# Altium schematic sheet Console.SchDoc
size 209 x 297 mm; SheetNumber: 4; SheetTotal: 4; PageSetup: Record=PageOptionsZCenterHorizontal=TrueZCenterVertical=TrueZPrintScale=0.95ZXCorrection=1.00ZYCorrection=1.00ZPrintKind=2ZBorderSize=5000000ZLeftOffset=0ZBottomOffset=0ZOrientation=1ZPaperLength=1000ZPaperWidth=1000ZScale=100ZPaperSource=7ZPrintQuality=600ZMediaType=1ZDitherType=10ZPaperKind=A4 (210 x 297 мм)ZPrintScaleMode=1
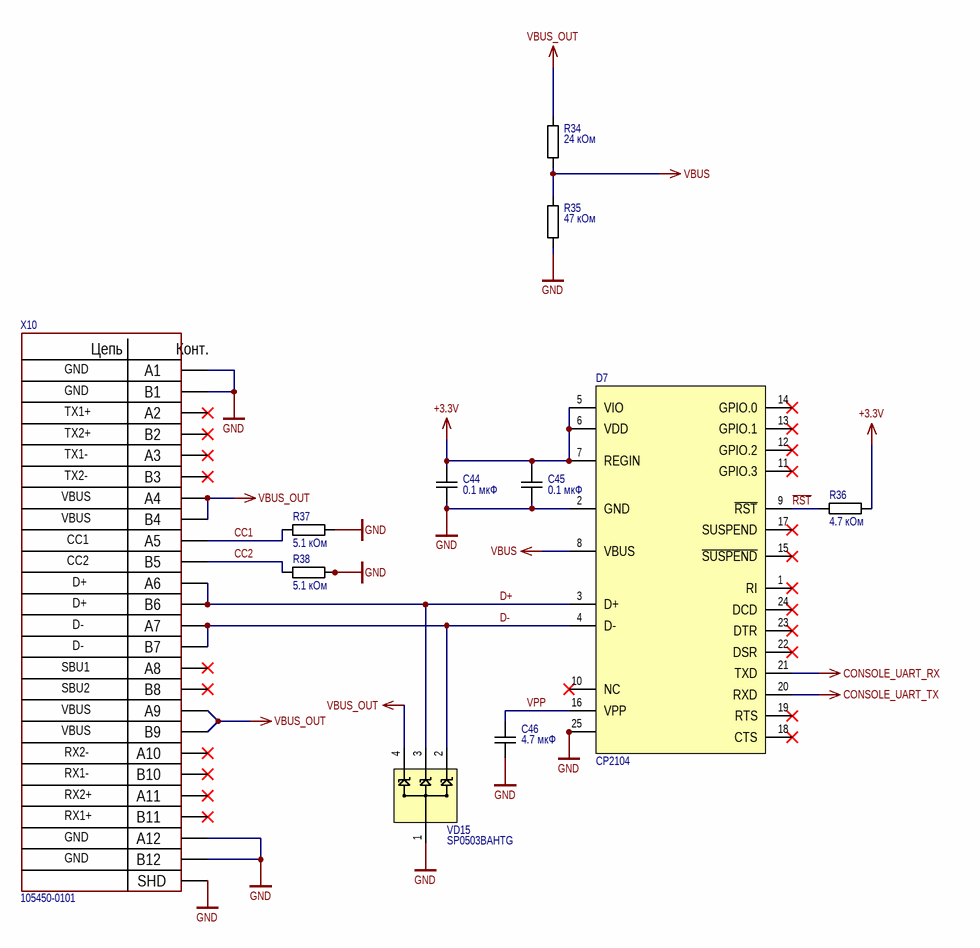
[diagram p0: Console.SchDoc]

## Parts
C44  value 0.1 мкФ  [CAP-0603]  (hidden comment: CAP-0.1 мкФ-10%-16 В-X7R-0603)
C45  value 0.1 мкФ  [CAP-0603]  (hidden comment: CAP-0.1 мкФ-10%-16 В-X7R-0603)
C46  value 4.7 мкФ  [CAP-0603]  (hidden comment: CAP-4.7 мкФ-10%-35 В-X5R-0603)
D7  CP2104  [QFN-24]
R34  value 24 кОм  [RES-0603]  (hidden comment: RES-24 кОм-1%-0.1 Вт-0603)
R35  value 47 кОм  [RES-0603]  (hidden comment: RES-47 кОм-1%-0.1 Вт-0603)
R36  value 4.7 кОм  [RES-0603]  (hidden comment: RES-4.7 кОм-1%-0.1 Вт-0603)
R37  value 5.1 кОм  [RES-0603]  (hidden comment: RES-5.1 кОм-1%-0.1 Вт-0603)
R38  value 5.1 кОм  [RES-0603]  (hidden comment: RES-5.1 кОм-1%-0.1 Вт-0603)
VD15  SP0503BAHTG  [SOT-143]
X10  105450-0101  B12: GND  B11: RX1+  A11: RX2+  B10: RX1-  A10: RX2-  B9: VBUS  B8: SBU2  A8: SBU1  B7: D-  B6: D+  B5: CC2  A5: CC1  B3: TX2-  A3: TX1-  B2: TX2+  A2: TX1+  [USB-C]

## Nets
+3.3V: C44.2 C45.2 D7.5(VIO) D7.6(VDD) D7.7(REGIN) R36.1
CONSOLE_UART_RX: D7.21(TXD)
CONSOLE_UART_TX: D7.20(RXD)
GND: C44.1 C45.1 C46.1 D7.2(GND) D7.25 R35.2 R37.1 R38.1 VD15.1 X10.A1 X10.A12 X10.B1 X10.B12 X10.SHD
VBUS: D7.8(VBUS) R34.2 R35.1
VBUS_OUT: R34.1 VD15.4 X10.A4 X10.A9 X10.B4 X10.B9
CC1: R37.2 X10.A5
CC2: R38.2 X10.B5
D+: D7.3(D+) VD15.3 X10.A6 X10.B6
D-: D7.4(D-) VD15.2 X10.A7 X10.B7
~{RST}: D7.9(~{RST}) R36.2
VPP: C46.2 D7.16(VPP)

Not connected (* = marked no-connect by the designer): D7 1(RI)* 10(NC)* 11(GPIO.3)* 12(GPIO.2)* 13(GPIO.1)* 14(GPIO.0)* 15(~{SUSPEND})* 17(SUSPEND)* 18(CTS)* 19(RTS)* 22(DSR)* 23(DTR)* 24(DCD)*; X10 2(B2)* A2* A3* A8* A10* A11* B3* B8* B10* B11*

## Notes on the sheet
- Перв. примен.
- Справ. №
- Подп. и дата
- Инв. № дубл.
- Взам. инв. №
- Изм.
- Лист
- № докум.
- Подп.
- Дата
- Инв. № подл.
- Копировал
- Формат А4
- (in symbol 105450-0101) Цепь; Конт.

## Library data of the parts
C44 C45 = Cap_0603: Конденсатор; Manufacturer Part Number: GRM188R71C104KA01D; Tolerance: 10%; Voltage: 16 В; Temperature: X7R; Supplier 1: https://www.chipdip.ru/product/grm188r71c104ka01d
C46 = Cap_0603: Конденсатор; Manufacturer Part Number: GRM188R6YA475KE15D; Tolerance: 10%; Voltage: 35 В; Temperature: X5R; Supplier 1: https://www.chipdip.ru/product0/8021864804
D7 = CP2104-F03-GMR: Interface IC full speed basic USB type-C controller USB 2.0 3.3V, CP2104-F03-GMR, WFQFN-24; Manufacturer: Silicon Labs; Supplier: Mouser; Supplier Part Number: 634-CP2104-F03-GMR; Manufacturer Part Number: CP2104-F03-GMR; RoHS: Yes; Category: Interface ICs; Stock: 2589; Pricing: 1=5,43, 10=4,87, 50=4,87, 100=3,99, 1000=2,87, 10000=2,62 (USD); Height: 800um; ComponentLink1URL: https://datasheet.ciiva.com/14939/cp2104-14939979.pdf?src-supplier=Digikey; ComponentLink1Description: https://datasheet.ciiva.com/14939/cp2104-14939979.pdf?src-supplier=Digikey; ComponentLink2URL: https://datasheet.ciiva.com/15150/getdatasheetpartid-711722-15150533.pdf?src-supplier=Verical; ComponentLink2Description: https://datasheet.ciiva.com/15150/getdatasheetpartid-711722-15150533.pdf?src-supplier=Verical; Supplier 1: https://www.chipdip.ru/product0/8023203867
R34 = Res_0603: Резистор; Manufacturer Part Number: RC0603FR-0724KL; Power: 0.1 Вт; Tolerance: 1%; Supplier 1: https://www.chipdip.ru/product/0.1w-0603-24-kom-1
R35 = Res_0603: Резистор; Manufacturer Part Number: RC0603FR-0747KL; Power: 0.1 Вт; Tolerance: 1%; Supplier 1: https://www.chipdip.ru/product/0.1w-0603-47-kom-1
R36 = Res_0603: Резистор; Manufacturer Part Number: RC0603FR-074K7L; Power: 0.1 Вт; Tolerance: 1%; Supplier 1: https://www.chipdip.ru/product/0.1w-0603-4.7-kom-1
R37 R38 = Res_0603: Резистор; Manufacturer Part Number: RC0603FR-075K1L; Power: 0.1 Вт; Tolerance: 1%; Supplier 1: https://www.chipdip.ru/product/0.1w-0603-5.1-kom-1
VD15 = SP0503BAHTG: SP050xBA Series 8.5 V 30 pF Triple Uni-Directional TVS Avalanche Diode-SOT143-4; Manufacturer: Littelfuse; Operating Supply Voltage: 5.5V; Direction: Unidirectional; Value: 30pF; Number of Channels: 3; Clamping Voltage: 7.8V; Power Line Protection: No; Polarity: Bidirectional,Unidirectional; Max Power Dissipation: 225mW; ESD Protection: Yes; Max Reverse Leakage Current: 100nA; Voltage Rating (DC): 5V; Clamping Voltage-Max: 8V; Supplier: Arrow Electronics; Supplier Part Number: SP0503BAHTG; Manufacturer Part Number: SP0503BAHTG; RoHS: Yes; Category: TVS Diodes; Stock: 87000; Pricing: 3000=0,2519, 9000=0,2382 (USD); Mounting Technology: Surface Mount; Case/Package: SOT-143; Pins: 4; Min Operating Temperature: -40°C; Max Operating Temperature: 85°C; Packaging: Tape and Reel; Number of Unidirectional Channels: 3; Reverse Standoff Voltage: 5.5V; Breakdown Voltage: 5.5V; Termination: SMD/SMT; Working Voltage: 5.5V; Peak Pulse Power: 225mW; Leakage Current: 100nA; Number of Elements: 3; Power Dissipation: 225mW; Diode Type: Avalanche; Series: SP05, SPA®; Length: 3.04mm; Width: 1.4mm; Height: 1.05mm; Depth: 1.4mm; Radiation Hardening: No; Reach SVHC Compliant: No; Lead Free: Lead Free; RoHS Compliant: Yes; ComponentLink1URL: https://datasheet.ciiva.com/15143/getdatasheetpartid-116020-15143550.pdf?src-supplier=Verical; ComponentLink1Description: https://datasheet.ciiva.com/15143/getdatasheetpartid-116020-15143550.pdf?src-supplier=Verical; ComponentLink2URL: https://datasheet.ciiva.com/7650/526672-7650894.pdf?src-supplier=Element14; ComponentLink2Description: https://datasheet.ciiva.com/7650/526672-7650894.pdf?src-supplier=Element14; ComponentLink3URL: https://datasheet.ciiva.com/8062/littefuse-spa-sp050x-8062422.pdf?src-supplier=Element14; ComponentLink3Description: https://datasheet.ciiva.com/8062/littefuse-spa-sp050x-8062422.pdf?src-supplier=Element14; ComponentLink4URL: https://datasheet.ciiva.com/22697/1911798-22697942.pdf?src-supplier=Element14; ComponentLink4Description: https://datasheet.ciiva.com/22697/1911798-22697942.pdf?src-supplier=Element14; ComponentLink5URL: https://datasheet.ciiva.com/4509/sp05x-leadfree-4509162.pdf?src-supplier=Mouser; ComponentLink5Description: https://datasheet.ciiva.com/4509/sp05x-leadfree-4509162.pdf?src-supplier=Mouser; ComponentLink6URL: https://datasheet.ciiva.com/332/sp05xxba-332551.pdf?src-supplier=Digikey; ComponentLink6Description: https://datasheet.ciiva.com/332/sp05xxba-332551.pdf?src-supplier=Digikey; ComponentLink7URL: https://datasheet.ciiva.com/332/sp05xxba-332552.pdf?src-supplier=Digikey; ComponentLink7Description: https://datasheet.ciiva.com/332/sp05xxba-332552.pdf?src-supplier=Digikey; ComponentLink8URL: https://datasheet.ciiva.com/332/sp05xxba-332550.pdf?src-supplier=Digikey; ComponentLink8Description: https://datasheet.ciiva.com/332/sp05xxba-332550.pdf?src-supplier=Digikey; ComponentLink9URL: https://datasheet.ciiva.com/16449/sp05xxba-16449463.pdf?src-supplier=Future+Electronics; ComponentLink9Description: https://datasheet.ciiva.com/16449/sp05xxba-16449463.pdf?src-supplier=Future+Electronics; Supplier 1: https://www.chipdip.ru/product/sp0503bahtg
X10 = 105450-0101: USB Connector, 24 Contact(s), Female, Right Angle, Surface Mount Terminal, Receptacle; Manufacturer: Molex; Plating: 157ConductorMaterial; Number of Contacts: 24; Number of Ports: 1; USB Standard: USB 3.1; Mating Cycles: 10000; Shielding: Shielded; Number of Circuits: 24NUMBER; Voltage Rating: 30V; Pitch: 0.5mm; Supplier: Mouser; Supplier Part Number: 538-105450-0101; Manufacturer Part Number: 105450-0101; RoHS: Yes; Category: USB Connectors; Stock: 17652; Pricing: 1=2,38, 10=2,03, 50=2,03, 100=1,79, 1000=1,67, 10000=1,41 (USD); Mounting Technology: Surface Mount,Horizontal,Through Hole; Case/Package: 0101; Pins: 24; Contact Material: Copper Alloy; Contact Plating: Gold; Housing Material: Thermoplastic; Insulation Color: Black; Min Operating Temperature: -30°C; Max Operating Temperature: 85°C; Packaging: Tape and Reel; Connector Type: USB; Gender: Receptacle; Orientation: Right Angle; Termination: Solder; Features: Shielded; Series: -; Number of Rows: 2NUMBER; Length: 8.94mm; Height: 3.44mm; Flammability Rating: UL94 V-0; RoHS Compliant: Yes; Reach SVHC Compliant: Unknown; ComponentLink1URL: http://www.farnell.com/datasheets/2801634.pdf?src-supplier=Farnell; ComponentLink1Description: http://www.farnell.com/datasheets/2801634.pdf?src-supplier=Farnell; ComponentLink2URL: http://www.farnell.com/datasheets/2801634.pdf?src-supplier=Newark; ComponentLink2Description: http://www.farnell.com/datasheets/2801634.pdf?src-supplier=Newark; ComponentLink3URL: http://www.literature.molex.com/SQLImages/kelmscott/Molex/PDF_Images/987651-4081.PDF?src-supplier=Avnet; ComponentLink3Description: http://www.literature.molex.com/SQLImages/kelmscott/Molex/PDF_Images/987651-4081.PDF?src-supplier=Avnet; ComponentLink4URL: http://www.farnell.com/datasheets/2015275.pdf?src-supplier=Element14; ComponentLink4Description: http://www.farnell.com/datasheets/2015275.pdf?src-supplier=Element14; ComponentLink5URL: http://www.farnell.com/datasheets/2801634.pdf?src-supplier=Element14; ComponentLink5Description: http://www.farnell.com/datasheets/2801634.pdf?src-supplier=Element14; ComponentLink6URL: http://www.farnell.com/datasheets/2672741.pdf?src-supplier=Newark; ComponentLink6Description: http://www.farnell.com/datasheets/2672741.pdf?src-supplier=Newark; Supplier 1: https://www.chipdip.ru/product/105450-0101-molex; A12: GND; A9: VBUS; A7: D-; A6: D+; B4: VBUS; A4: VBUS; B1: GND; A1: GND